# Altium schematic sheet Health_module.SchDoc
size A4
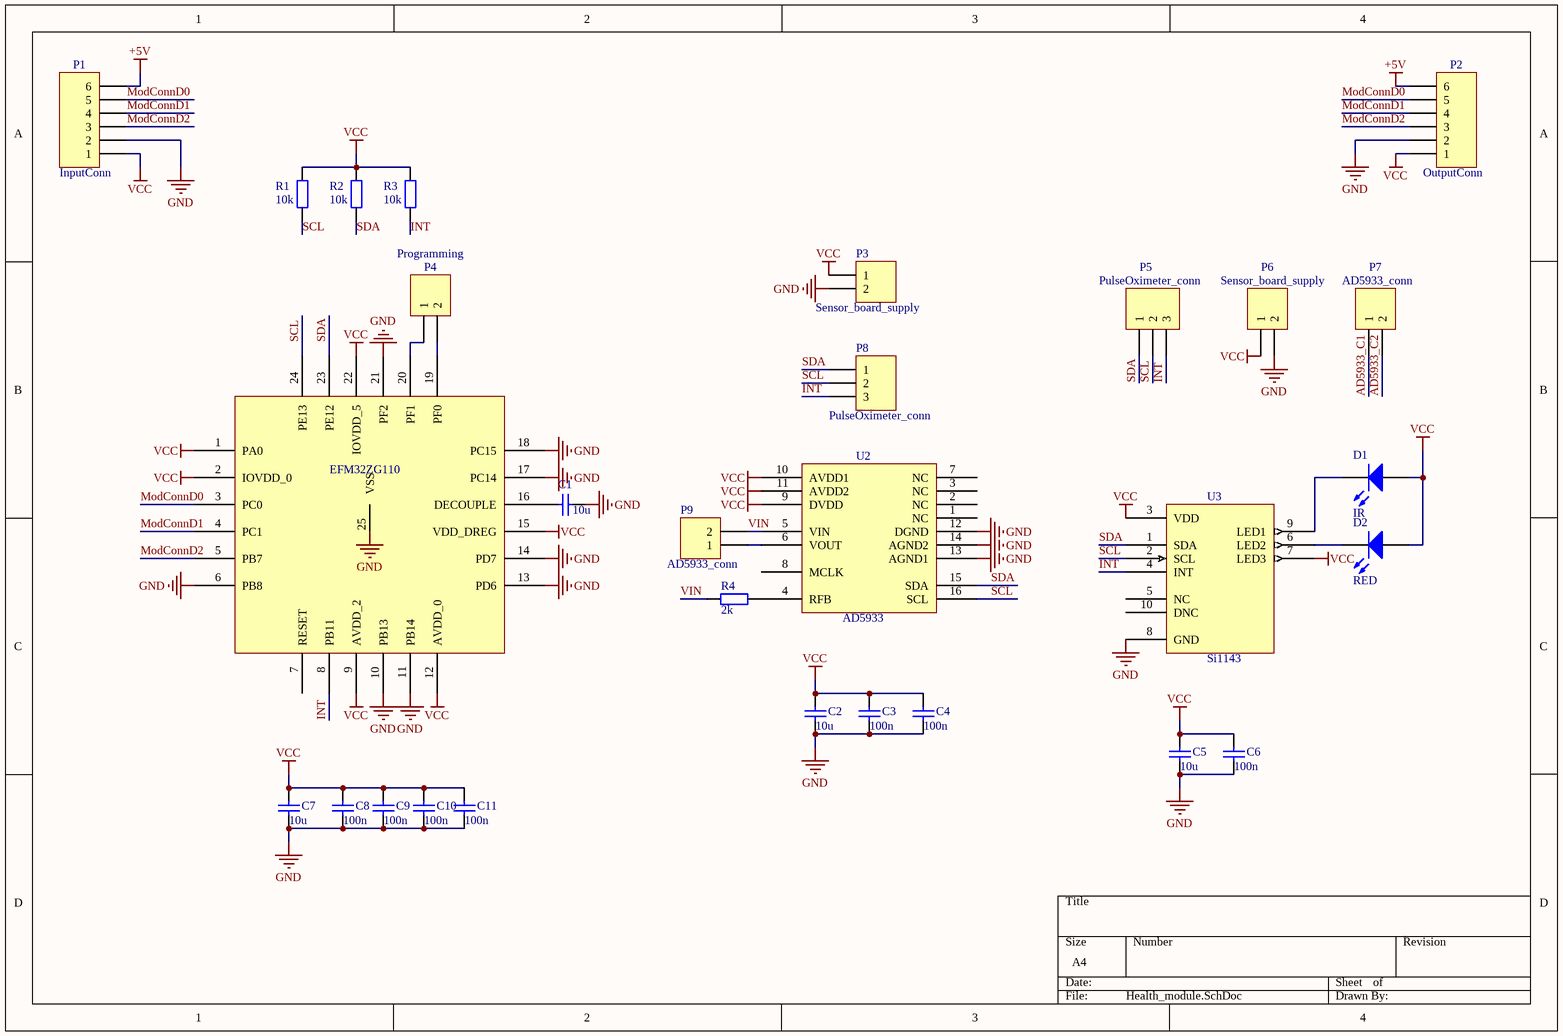
[diagram p0: Health_module.SchDoc]

## Parts
C1  10u  [0805]
C2  10u  [0805]
C3  value 100n  [0402]  (hidden comment: Cap Semi)
C4  value 100n  [0402]  (hidden comment: Cap Semi)
C5  10u  [0805]
C6  value 100n  [0402]  (hidden comment: Cap Semi)
C7  10u  [0805]
C8  value 100n  [0402]  (hidden comment: Cap Semi)
C9  value 100n  [0402]  (hidden comment: Cap Semi)
C10  value 100n  [0402]  (hidden comment: Cap Semi)
C11  value 100n  [0402]  (hidden comment: Cap Semi)
D1  IR  [0603]
D2  RED  [0603]
P1  InputConn  [Goldpin6_1.27mm]
P2  OutputConn  [Goldpin6_1.27mm]
P3  Sensor_board_supply  [2pinConn_2mmSquare_2.54mmSpaced]
P4  Programming  [GeckoProgramming]
P5  PulseOximeter_conn  [3pinConn_2mmSquare_2.54spaced]
P6  Sensor_board_supply  [2pinConn_2mmSquare_2.54mmSpaced]
P7  AD5933_conn  [2pinConn_2mmSquare_2.54mmSpaced]
P8  PulseOximeter_conn  [3pinConn_2mmSquare_2.54spaced]
P9  AD5933_conn  [2pinConn_2mmSquare_2.54mmSpaced]
R1  value 10k  [0402]  (hidden comment: Res2)
R2  value 10k  [0402]  (hidden comment: Res2)
R3  value 10k  [0402]  (hidden comment: Res2)
R4  value 2k  [0603]  (hidden comment: Res2)
U1  EFM32ZG110  [QFN24_5x5_0.65]
U2  AD5933  [SSOP16]
U3  Si1143  [Si1143]

## Nets
+5V: P1.6 P2.6
GND: C1.1 C2.1 C3.1 C4.1 C5.1 C6.1 C7.1 C8.1 C9.1 C10.1 C11.1 P1.2 P2.2 P3.2 P6.2 U1.6(PB8) U1.10(PB13) U1.11(PB14) U1.13(PD6) U1.14(PD7) U1.17(PC14) U1.18(PC15) U1.21(PF2) U1.25(VSS) U2.12(DGND) U2.13(AGND1) U2.14(AGND2) U3.8(GND)
VCC: C2.2 C3.2 C4.2 C5.2 C6.2 C7.2 C8.2 C9.2 C10.2 C11.2 D1.1(A) D2.1(A) P1.1 P2.1 P3.1 P6.1 R1.2 R2.2 R3.2 U1.1(PA0) U1.2(IOVDD_0) U1.9(AVDD_2) U1.12(AVDD_0) U1.15(VDD_DREG) U1.22(IOVDD_5) U2.9(DVDD) U2.10(AVDD1) U2.11(AVDD2) U3.3(VDD) U3.7(LED3)
AD5933_C1: P7.1
AD5933_C2: P7.2
INT: P5.3 P8.3 R3.1 U1.8(PB11) U3.4(INT)
ModConnD0: P1.5 P2.5 U1.3(PC0)
ModConnD1: P1.4 P2.4 U1.4(PC1)
ModConnD2: P1.3 P2.3 U1.5(PB7)
SCL: P5.2 P8.2 R1.1 U1.24(PE13) U2.16(SCL) U3.2(SCL)
SDA: P5.1 P8.1 R2.1 U1.23(PE12) U2.15(SDA) U3.1(SDA)
VIN: P9.2 R4.2 U2.5(VIN)
NetC1_2: C1.2 U1.16(DECOUPLE)
NetD1_2: D1.2(K) U3.9(LED1)
NetD2_2: D2.2(K) U3.6(LED2)
NetP4_1: P4.1 U1.20(PF1)
NetP4_2: P4.2 U1.19(PF0)
NetP9_1: P9.1 U2.6(VOUT)
NetR4_1: R4.1 U2.4(RFB)

Not connected (* = marked no-connect by the designer): U1 7(RESET); U2 1(NC) 2(NC) 3(NC) 7(NC) 8(MCLK); U3 5(NC) 10(DNC)

## Library data of the parts
C1-C11 = Cap Semi: Capacitor (Semiconductor SIM Model); Published: 8-Jun-2000; LatestRevisionDate: 29-May-2009; LatestRevisionNote: IPC-7351 Footprint Added.; PackageReference: C1206; Publisher: Altium Limited; PackageDescription: Chip Capacitor
  C1 C2 C5 C7: Value: 10u
D1 D2 = LED0: Typical INFRARED GaAs LED; Published: 8-Jun-2000; LatestRevisionDate: 08-Jul-2005; LatestRevisionNote: Mech Layer 1 removed.; PackageReference: LED-0; Publisher: Altium Limited; PackageDescription: LED; 2 Leads
P1 P2 = MHDR1X6: Header, 6-Pin; LatestRevisionDate: 17-Jul-2002; LatestRevisionNote: Re-released for DXP Platform.; Publisher: Altium Limited
P3 P4 P6 = MHDR1X2: Header, 2-Pin; LatestRevisionDate: 17-Jul-2002; LatestRevisionNote: Re-released for DXP Platform.; Publisher: Altium Limited
P5 P8 = Header 3: LatestRevisionDate: 17-Jul-2002; LatestRevisionNote: Re-released for DXP Platform.; Publisher: Altium Limited
P7 P9 = Header 2: Header, 2-Pin; LatestRevisionDate: 17-Jul-2002; LatestRevisionNote: Re-released for DXP Platform.; Publisher: Altium Limited
R1-R4 = Res2: Resistor; Published: 8-Jun-2000; LatestRevisionDate: 17-Jul-2002; LatestRevisionNote: Re-released for DXP Platform.; PackageReference: AXIAL-0.4; Publisher: Altium Limited; PackageDescription: Axial Device, Thru-Hole; 2 Leads; 0.4 in Pin Spacing